# EAGLE design moja-col2 (EAGLE 6.4)
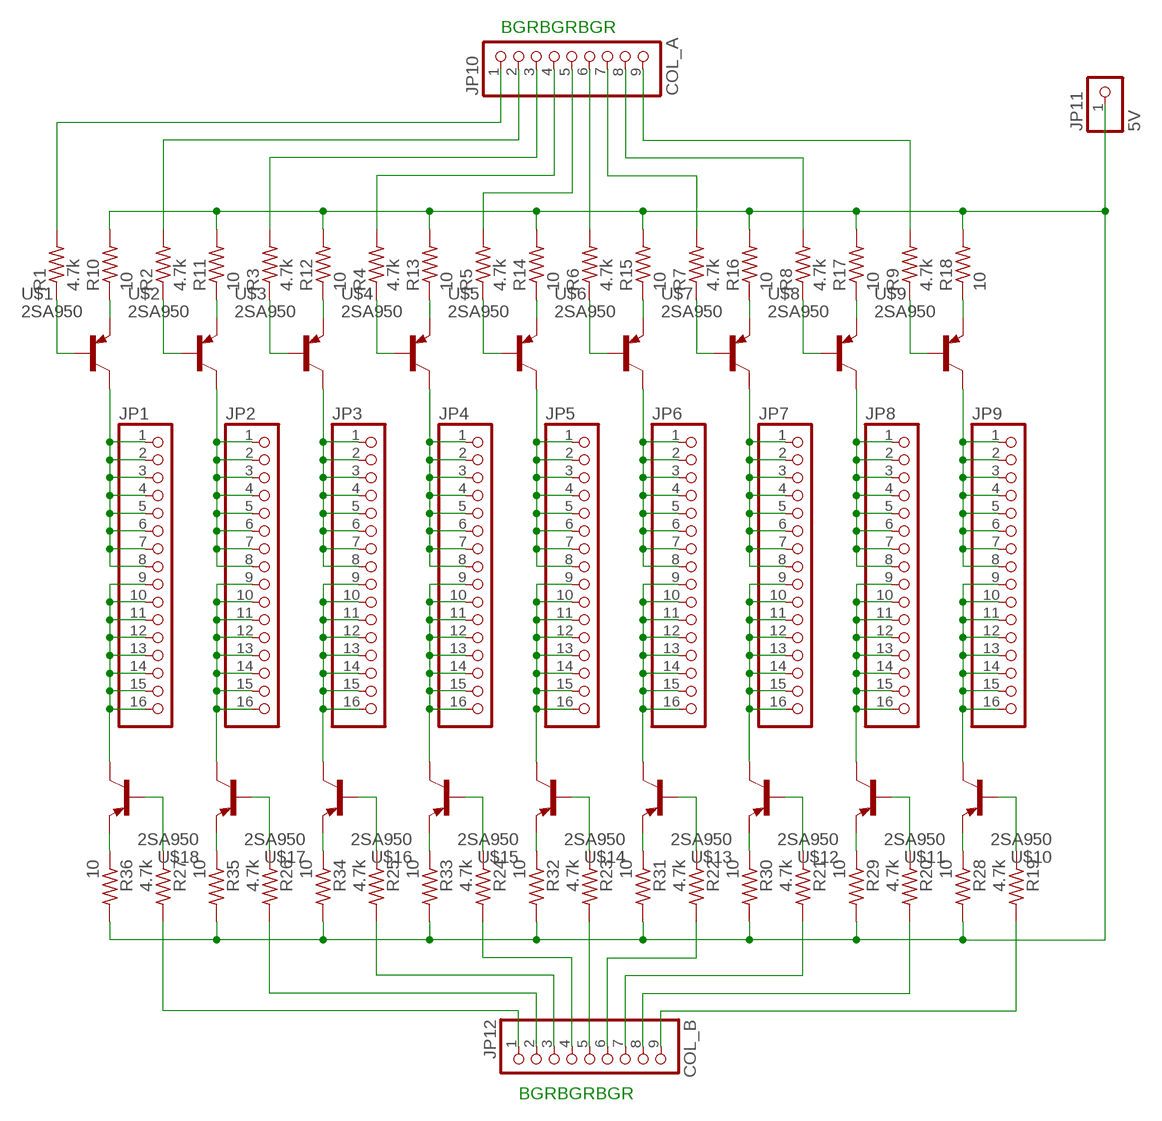
[diagram p0: schematic, sheet 1]

## Parts
JP1  PINHD-1X16  [1X16]
JP2  PINHD-1X16  [1X16]
JP3  PINHD-1X16  [1X16]
JP4  PINHD-1X16  [1X16]
JP5  PINHD-1X16  [1X16]
JP6  PINHD-1X16  [1X16]
JP7  PINHD-1X16  [1X16]
JP8  PINHD-1X16  [1X16]
JP9  PINHD-1X16  [1X16]
JP10  COL_A  PINHD-1X9  [1X09]
JP11  5V  PINHD-1X1  [1X01]
JP12  COL_B  PINHD-1X9  [1X09]
R1  4.7k  R-US_0204/2V  [0204V]
R2  4.7k  R-US_0204/2V  [0204V]
R3  4.7k  R-US_0204/2V  [0204V]
R4  4.7k  R-US_0204/2V  [0204V]
R5  4.7k  R-US_0204/2V  [0204V]
R6  4.7k  R-US_0204/2V  [0204V]
R7  4.7k  R-US_0204/2V  [0204V]
R8  4.7k  R-US_0204/2V  [0204V]
R9  4.7k  R-US_0204/2V  [0204V]
R10  10  R-US_0204/2V  [0204V]
R11  10  R-US_0204/2V  [0204V]
R12  10  R-US_0204/2V  [0204V]
R13  10  R-US_0204/2V  [0204V]
R14  10  R-US_0204/2V  [0204V]
R15  10  R-US_0204/2V  [0204V]
R16  10  R-US_0204/2V  [0204V]
R17  10  R-US_0204/2V  [0204V]
R18  10  R-US_0204/2V  [0204V]
R19  4.7k  R-US_0204/2V  [0204V]
R20  4.7k  R-US_0204/2V  [0204V]
R21  4.7k  R-US_0204/2V  [0204V]
R22  4.7k  R-US_0204/2V  [0204V]
R23  4.7k  R-US_0204/2V  [0204V]
R24  4.7k  R-US_0204/2V  [0204V]
R25  4.7k  R-US_0204/2V  [0204V]
R26  4.7k  R-US_0204/2V  [0204V]
R27  4.7k  R-US_0204/2V  [0204V]
R28  10  R-US_0204/2V  [0204V]
R29  10  R-US_0204/2V  [0204V]
R30  10  R-US_0204/2V  [0204V]
R31  10  R-US_0204/2V  [0204V]
R32  10  R-US_0204/2V  [0204V]
R33  10  R-US_0204/2V  [0204V]
R34  10  R-US_0204/2V  [0204V]
R35  10  R-US_0204/2V  [0204V]
R36  10  R-US_0204/2V  [0204V]
U$1  2SA950  [TO-92-AMMO]
U$2  2SA950  [TO-92-AMMO]
U$3  2SA950  [TO-92-AMMO]
U$4  2SA950  [TO-92-AMMO]
U$5  2SA950  [TO-92-AMMO]
U$6  2SA950  [TO-92-AMMO]
U$7  2SA950  [TO-92-AMMO]
U$8  2SA950  [TO-92-AMMO]
U$9  2SA950  [TO-92-AMMO]
U$10  2SA950  [TO-92-AMMO]
U$11  2SA950  [TO-92-AMMO]
U$12  2SA950  [TO-92-AMMO]
U$13  2SA950  [TO-92-AMMO]
U$14  2SA950  [TO-92-AMMO]
U$15  2SA950  [TO-92-AMMO]
U$16  2SA950  [TO-92-AMMO]
U$17  2SA950  [TO-92-AMMO]
U$18  2SA950  [TO-92-AMMO]

## Nets
N$1: JP1.1 JP1.2 JP1.3 JP1.4 JP1.5 JP1.6 JP1.7 JP1.8 U$1.2(C)
N$2: JP2.1 JP2.2 JP2.3 JP2.4 JP2.5 JP2.6 JP2.7 JP2.8 U$2.2(C)
N$3: JP3.1 JP3.2 JP3.3 JP3.4 JP3.5 JP3.6 JP3.7 JP3.8 U$3.2(C)
N$4: JP4.1 JP4.2 JP4.3 JP4.4 JP4.5 JP4.6 JP4.7 JP4.8 U$4.2(C)
N$5: JP5.1 JP5.2 JP5.3 JP5.4 JP5.5 JP5.6 JP5.7 JP5.8 U$5.2(C)
N$6: JP6.1 JP6.2 JP6.3 JP6.4 JP6.5 JP6.6 JP6.7 JP6.8 U$6.2(C)
N$7: JP7.1 JP7.2 JP7.3 JP7.4 JP7.5 JP7.6 JP7.7 JP7.8 U$7.2(C)
N$8: JP8.1 JP8.2 JP8.3 JP8.4 JP8.5 JP8.6 JP8.7 JP8.8 U$8.2(C)
N$9: JP9.1 JP9.2 JP9.3 JP9.4 JP9.5 JP9.6 JP9.7 JP9.8 U$9.2(C)
N$10: JP10.1 R1.2
N$11: JP10.2 R2.2
N$12: JP10.3 R3.2
N$13: JP10.4 R4.2
N$14: JP10.5 R5.2
N$15: JP10.6 R6.2
N$16: JP10.7 R7.2
N$17: JP10.8 R8.2
N$18: JP10.9 R9.2
N$19: JP1.9 JP1.10 JP1.11 JP1.12 JP1.13 JP1.14 JP1.15 JP1.16 U$18.2(C)
N$20: JP2.9 JP2.10 JP2.11 JP2.12 JP2.13 JP2.14 JP2.15 JP2.16 U$17.2(C)
N$21: JP3.9 JP3.10 JP3.11 JP3.12 JP3.13 JP3.14 JP3.15 JP3.16 U$16.2(C)
N$22: JP4.9 JP4.10 JP4.11 JP4.12 JP4.13 JP4.14 JP4.15 JP4.16 U$15.2(C)
N$23: JP5.9 JP5.10 JP5.11 JP5.12 JP5.13 JP5.14 JP5.15 JP5.16 U$14.2(C)
N$24: JP6.9 JP6.10 JP6.11 JP6.12 JP6.13 JP6.14 JP6.15 JP6.16 U$13.2(C)
N$25: JP7.9 JP7.10 JP7.11 JP7.12 JP7.13 JP7.14 JP7.15 JP7.16 U$12.2(C)
N$26: JP8.9 JP8.10 JP8.11 JP8.12 JP8.13 JP8.14 JP8.15 JP8.16 U$11.2(C)
N$27: JP9.9 JP9.10 JP9.11 JP9.12 JP9.13 JP9.14 JP9.15 JP9.16 U$10.2(C)
N$28: R1.1 U$1.3(B)
N$29: R2.1 U$2.3(B)
N$30: R3.1 U$3.3(B)
N$31: R4.1 U$4.3(B)
N$32: R5.1 U$5.3(B)
N$33: R6.1 U$6.3(B)
N$34: R7.1 U$7.3(B)
N$35: R8.1 U$8.3(B)
N$36: R9.1 U$9.3(B)
N$38: R10.1 U$1.1(E)
N$39: R11.1 U$2.1(E)
N$40: R12.1 U$3.1(E)
N$41: R13.1 U$4.1(E)
N$42: R14.1 U$5.1(E)
N$43: R15.1 U$6.1(E)
N$44: R16.1 U$7.1(E)
N$45: R17.1 U$8.1(E)
N$46: R18.1 U$9.1(E)
N$49: JP12.4 R24.2
N$56: JP12.9 R19.2
N$57: JP12.8 R20.2
N$58: JP12.7 R21.2
N$59: JP12.6 R22.2
N$60: JP12.5 R23.2
N$62: JP12.3 R25.2
N$63: JP12.2 R26.2
N$64: JP12.1 R27.2
N$65: R19.1 U$10.3(B)
N$66: R20.1 U$11.3(B)
N$67: R21.1 U$12.3(B)
N$68: R22.1 U$13.3(B)
N$69: R23.1 U$14.3(B)
N$70: R24.1 U$15.3(B)
N$71: R25.1 U$16.3(B)
N$72: R26.1 U$17.3(B)
N$73: R27.1 U$18.3(B)
N$74: JP11.1 R10.2 R11.2 R12.2 R13.2 R14.2 R15.2 R16.2 R17.2 R18.2 R28.2 R29.2 R30.2 R31.2 R32.2 R33.2 R34.2 R35.2 R36.2
N$75: R28.1 U$10.1(E)
N$76: R29.1 U$11.1(E)
N$77: R30.1 U$12.1(E)
N$78: R31.1 U$13.1(E)
N$79: R32.1 U$14.1(E)
N$80: R33.1 U$15.1(E)
N$81: R34.1 U$16.1(E)
N$82: R35.1 U$17.1(E)
N$83: R36.1 U$18.1(E)

## Notes on the sheet
- BGRBGRBGR
- BGRBGRBGR

## Library data of the parts
JP1-JP9 = pinhead:PINHD-1X16: PIN HEADER
JP10 JP12 = pinhead:PINHD-1X9: PIN HEADER
JP11 = pinhead:PINHD-1X1: PIN HEADER
R1-R36 = resistor:R-US_: RESISTOR, American symbol
U$1-U$18 = jun930:2SA950

## Board
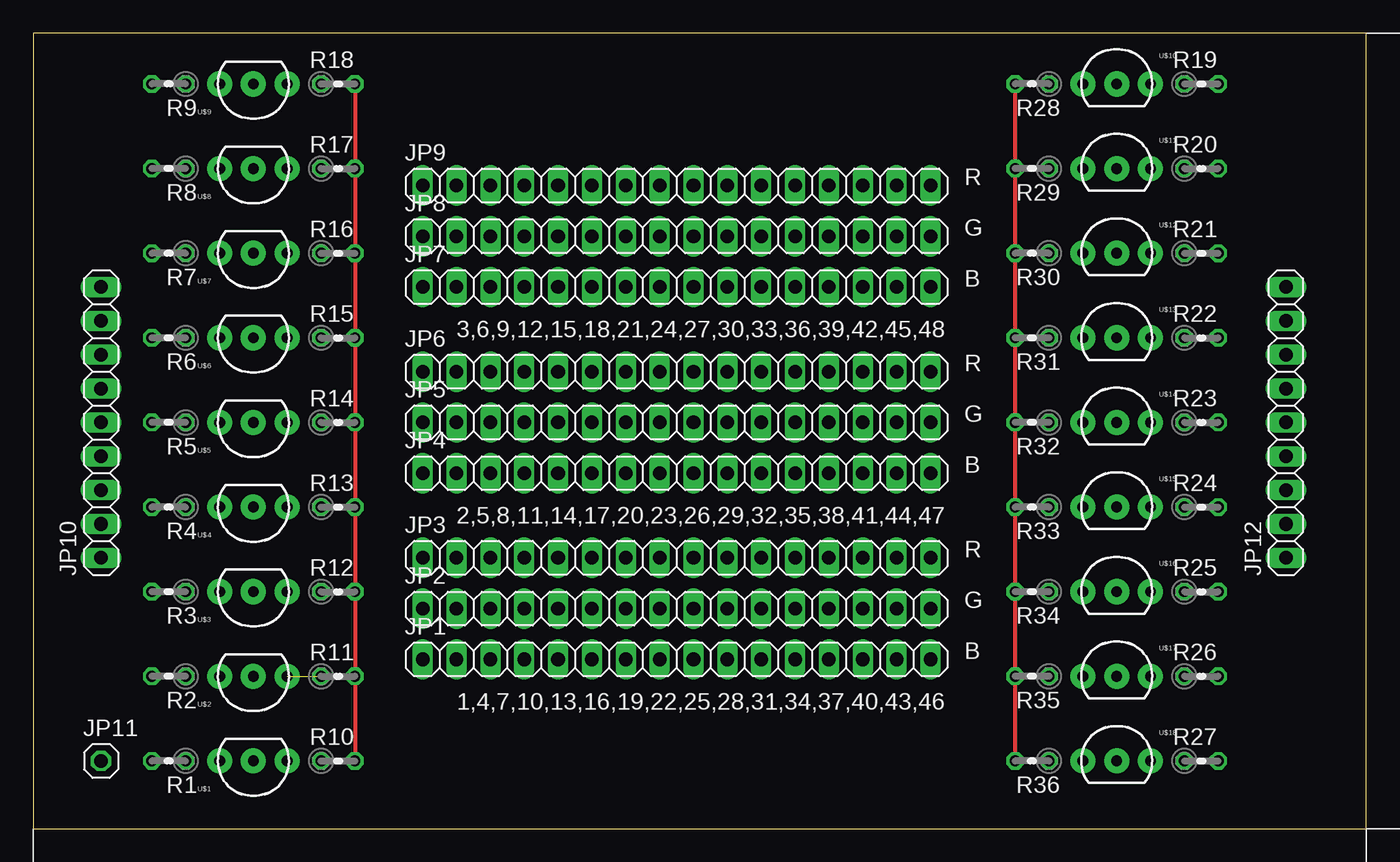
[diagram p1: board, top side]
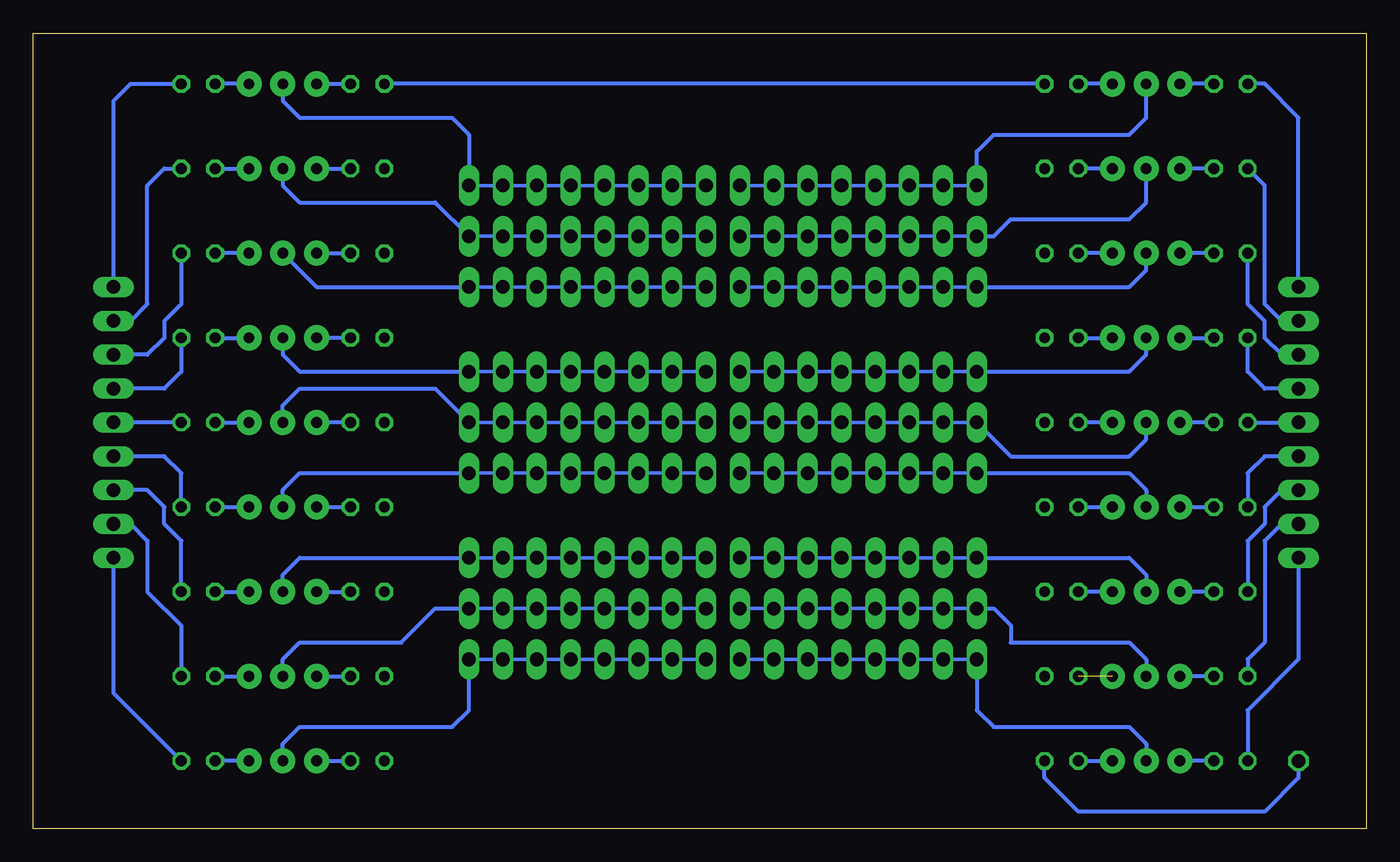
[diagram p2: board, bottom side, seen from below]

Size 100 x 59.68 mm. Coordinates in mm from the lower left corner, seen from the top.
Outline: 0,0 100,0 100,59.68 0,59.68 0,0
Copper layers (1*16): Top 0.035mm / dielectric 1.5mm / Bottom 0.035mm
Design rules "default": minimum track width 10mil, minimum drill 24mil, track to track 8mil, track to pad 8mil, pad to pad 8mil, via to via 8mil, smd to smd 8mil, copper to edge 40mil, drill to drill 8mil, minimum pad ring 10mil, minimum via ring 8mil, stop-mask expansion 4mil, vias tented up to drill 0mil, thermal gap 10mil

### Footprints (pad centres in the part's own frame; a part is rotated, then mirrored left to right if it is on the bottom)
1X16 = drill 1.016 long: 1 -19.05,0; 2 -16.51,0; 3 -13.97,0; 4 -11.43,0; 5 -8.89,0; 6 -6.35,0; 7 -3.81,0; 8 -1.27,0; 9 1.27,0; 10 3.81,0; 11 6.35,0; 12 8.89,0; 13 11.43,0; 14 13.97,0; 15 16.51,0; 16 19.05,0
1X09 = drill 1.016 long: 1 -10.16,0; 2 -7.62,0; 3 -5.08,0; 4 -2.54,0; 5 0,0; 6 2.54,0; 7 5.08,0; 8 7.62,0; 9 10.16,0
1X01 = drill 1.016 octagon: 1 0,0
0204V = drill 0.813 octagon: 1 -1.27,0; 2 1.27,0
TO-92-AMMO = drill 0.813 pad 1.88: 1 -2.54,0; 2 0,0; 3 2.54,0

### Placement (x,y rotation side)
JP1  48.26,12.7 0 top
JP2  48.26,16.51 0 top
JP3  48.26,20.32 0 top
JP4  48.26,26.67 0 top
JP5  48.26,30.48 0 top
JP6  48.26,34.29 0 top
JP7  48.26,40.64 0 top
JP8  48.26,44.45 0 top
JP9  48.26,48.26 0 top
JP10  5.08,30.48 90 top
JP11  5.08,5.08 0 top
JP12  93.98,30.48 90 top
R1  10.16,5.08 180 top
R2  10.16,11.43 180 top
R3  10.16,17.78 180 top
R4  10.16,24.13 180 top
R5  10.16,30.48 180 top
R6  10.16,36.83 180 top
R7  10.16,43.18 180 top
R8  10.16,49.53 180 top
R9  10.16,55.88 180 top
R10  22.86,5.08 0 top
R11  22.86,11.43 0 top
R12  22.86,17.78 0 top
R13  22.86,24.13 0 top
R14  22.86,30.48 0 top
R15  22.86,36.83 0 top
R16  22.86,43.18 0 top
R17  22.86,49.53 0 top
R18  22.86,55.88 0 top
R19  87.63,55.88 0 top
R20  87.63,49.53 0 top
R21  87.63,43.18 0 top
R22  87.63,36.83 0 top
R23  87.63,30.48 0 top
R24  87.63,24.13 0 top
R25  87.63,17.78 0 top
R26  87.63,11.43 0 top
R27  87.63,5.08 0 top
R28  74.93,55.88 180 top
R29  74.93,49.53 180 top
R30  74.93,43.18 180 top
R31  74.93,36.83 180 top
R32  74.93,30.48 180 top
R33  74.93,24.13 180 top
R34  74.93,17.78 180 top
R35  74.93,11.43 180 top
R36  74.93,5.08 180 top
U$1  16.51,5.08 180 top
U$2  16.51,11.43 180 top
U$3  16.51,17.78 180 top
U$4  16.51,24.13 180 top
U$5  16.51,30.48 180 top
U$6  16.51,36.83 180 top
U$7  16.51,43.18 180 top
U$8  16.51,49.53 180 top
U$9  16.51,55.88 180 top
U$10  81.28,55.88 0 top
U$11  81.28,49.53 0 top
U$12  81.28,43.18 0 top
U$13  81.28,36.83 0 top
U$14  81.28,30.48 0 top
U$15  81.28,24.13 0 top
U$16  81.28,17.78 0 top
U$17  81.28,11.43 0 top
U$18  81.28,5.08 0 top

### Tracks (layer width: path | path; a pad name or v marks a point on that pad's centre or on a via)
N$1
  Bottom 0.254: JP1.1 JP1.2 JP1.3 JP1.4 JP1.5 JP1.6 JP1.7 JP1.8
  Bottom 0.305: JP1.1 29.21,8.89 27.94,7.62 17.78,7.62 16.51,6.35 U$1.2
N$2
  Bottom 0.254: JP2.1 JP2.2 JP2.3 JP2.4 JP2.5 JP2.6 JP2.7 JP2.8
  Bottom 0.305: JP2.1 27.94,16.51 26.67,15.24 26.67,13.97 17.78,13.97 16.51,12.7 U$2.2
N$3
  Bottom 0.254: JP3.1 JP3.2 JP3.3 JP3.4 JP3.5 JP3.6 JP3.7 JP3.8
  Bottom 0.305: JP3.1 17.78,20.32 16.51,19.05 U$3.2
N$4
  Bottom 0.254: JP4.1 JP4.2 JP4.3 JP4.4 JP4.5 JP4.6 JP4.7 JP4.8
  Bottom 0.305: JP4.1 17.78,26.67 16.51,25.4 U$4.2
N$5
  Bottom 0.254: JP5.1 JP5.2 JP5.3 JP5.4 JP5.5 JP5.6 JP5.7 JP5.8
  Bottom 0.305: JP5.1 26.67,27.94 17.78,27.94 16.51,29.21 U$5.2
N$6
  Bottom 0.254: JP6.1 JP6.2 JP6.3 JP6.4 JP6.5 JP6.6 JP6.7 JP6.8
  Bottom 0.305: JP6.1 17.78,34.29 16.51,35.56 U$6.2
N$7
  Bottom 0.254: JP7.1 JP7.2 JP7.3 JP7.4 JP7.5 JP7.6 JP7.7 JP7.8
  Bottom 0.305: JP7.1 17.78,40.64 16.51,41.91 U$7.2
N$8
  Bottom 0.254: JP8.1 JP8.2 JP8.3 JP8.4 JP8.5 JP8.6 JP8.7 JP8.8
  Bottom 0.305: JP8.1 27.94,44.45 26.67,45.72 17.78,45.72 16.51,46.99 U$8.2
N$9
  Bottom 0.254: JP9.1 JP9.2 JP9.3 JP9.4 JP9.5 JP9.6 JP9.7 JP9.8
  Bottom 0.305: JP9.1 29.21,50.8 27.94,52.07 17.78,52.07 16.51,53.34 U$9.2
N$10
  Bottom 0.305: JP10.1 5.08,12.7 8.89,8.89 R1.2
N$11
  Bottom 0.305: JP10.2 6.35,22.86 7.62,21.59 7.62,13.97 8.89,12.7 R2.2
N$12
  Bottom 0.305: JP10.3 6.35,25.4 7.62,24.13 7.62,22.86 8.89,21.59 R3.2
N$13
  Bottom 0.305: JP10.4 7.62,27.94 8.89,26.67 R4.2
N$14
  Bottom 0.305: R5.2 JP10.5
N$15
  Bottom 0.305: JP10.6 7.62,33.02 8.89,34.29 R6.2
N$16
  Bottom 0.305: JP10.7 6.35,35.56 7.62,36.83 7.62,38.1 8.89,39.37 R7.2
N$17
  Bottom 0.305: JP10.8 6.35,38.1 7.62,39.37 7.62,48.26 R8.2
N$18
  Bottom 0.305: JP10.9 5.08,53.34 7.62,55.88 R9.2
N$19
  Bottom 0.254: JP1.9 JP1.10 JP1.11 JP1.12 JP1.13 JP1.14 JP1.15 JP1.16
  Bottom 0.305: U$18.2 81.28,6.35 80.01,7.62 68.58,7.62 67.31,8.89 JP1.16
N$20
  Bottom 0.254: JP2.9 JP2.10 JP2.11 JP2.12 JP2.13 JP2.14 JP2.15 JP2.16
  Bottom 0.305: U$17.2 81.28,12.7 80.01,13.97 72.39,13.97 69.85,16.51 JP2.16
N$21
  Bottom 0.254: JP3.9 JP3.10 JP3.11 JP3.12 JP3.13 JP3.14 JP3.15 JP3.16
  Bottom 0.305: U$16.2 81.28,19.05 80.01,20.32 JP3.16
N$22
  Bottom 0.254: JP4.9 JP4.10 JP4.11 JP4.12 JP4.13 JP4.14 JP4.15 JP4.16
  Bottom 0.305: U$15.2 81.28,25.4 80.01,26.67 JP4.16
N$23
  Bottom 0.254: JP5.9 JP5.10 JP5.11 JP5.12 JP5.13 JP5.14 JP5.15 JP5.16
  Bottom 0.305: U$14.2 81.28,31.75 80.01,33.02 69.85,33.02 JP5.16
N$24
  Bottom 0.254: JP6.9 JP6.10 JP6.11 JP6.12 JP6.13 JP6.14 JP6.15 JP6.16
  Bottom 0.305: U$13.2 81.28,35.56 80.01,34.29 JP6.16
N$25
  Bottom 0.254: JP7.9 JP7.10 JP7.11 JP7.12 JP7.13 JP7.14 JP7.15 JP7.16
  Bottom 0.305: U$12.2 78.74,40.64 JP7.16
N$26
  Bottom 0.254: JP8.9 JP8.10 JP8.11 JP8.12 JP8.13 JP8.14 JP8.15 JP8.16
  Bottom 0.305: U$11.2 81.28,48.26 80.01,46.99 69.85,46.99 JP8.16
N$27
  Bottom 0.254: JP9.9 JP9.10 JP9.11 JP9.12 JP9.13 JP9.14 JP9.15 JP9.16
  Bottom 0.305: U$10.2 81.28,54.61 80.01,53.34 68.58,53.34 67.31,52.07 JP9.16
N$28
  Bottom 0.305: R1.1 U$1.3
N$29
  Bottom 0.305: R2.1 U$2.3
N$30
  Bottom 0.305: R3.1 U$3.3
N$31
  Bottom 0.305: U$4.3 R4.1
N$32
  Bottom 0.305: R5.1 U$5.3
N$33
  Bottom 0.305: U$6.3 R6.1
N$34
  Bottom 0.305: R7.1 U$7.3
N$35
  Bottom 0.305: R8.1 U$8.3
N$36
  Bottom 0.305: R9.1 U$9.3
N$38
  Bottom 0.305: R10.1 U$1.1
N$39  (1 unrouted)
N$40
  Bottom 0.305: U$3.1 R12.1
N$41
  Bottom 0.305: R13.1 U$4.1
N$42
  Bottom 0.305: U$5.1 R14.1
N$43
  Bottom 0.305: R15.1 U$6.1
N$44
  Bottom 0.305: U$7.1 R16.1
N$45
  Bottom 0.305: U$8.1 R17.1
N$46
  Bottom 0.305: U$9.1 R18.1
N$49
  Bottom 0.305: R24.2 88.9,26.67 90.17,27.94 JP12.4
N$56
  Bottom 0.305: JP12.9 93.98,54.61 92.71,55.88 R19.2
N$57
  Bottom 0.305: JP12.8 92.71,38.1 91.44,39.37 91.44,48.26 90.17,49.53 R20.2
N$58
  Bottom 0.305: R21.2 88.9,39.37 90.17,38.1 90.17,36.83 91.44,35.56 JP12.7
N$59
  Bottom 0.305: R22.2 88.9,34.29 90.17,33.02 JP12.6
N$60
  Bottom 0.305: R23.2 JP12.5
N$62
  Bottom 0.305: R25.2 88.9,21.59 90.17,22.86 90.17,24.13 91.44,25.4 JP12.3
N$63
  Bottom 0.305: JP12.2 92.71,22.86 91.44,21.59 91.44,17.78 88.9,15.24 R26.2
N$64
  Bottom 0.305: R27.2 93.98,10.16 JP12.1
N$65
  Bottom 0.305: U$10.3 R19.1
N$66
  Bottom 0.305: R20.1 U$11.3
N$67
  Bottom 0.305: U$12.3 R21.1
N$68
  Bottom 0.305: R22.1 U$13.3
N$69
  Bottom 0.305: R23.1 U$14.3
N$70
  Bottom 0.305: R24.1 U$15.3
N$71
  Bottom 0.305: R25.1 U$16.3
N$72
  Bottom 0.305: R26.1 U$17.3
N$73
  Bottom 0.305: U$18.3 R27.1
N$74
  Top 0.305: R18.2 R17.2 R16.2 R15.2 R14.2 R13.2 R12.2 R11.2 R10.2 | R28.2 R29.2 R30.2 R31.2 R32.2 R33.2 R34.2 R35.2 R36.2
  Bottom 0.305: JP11.1 5.08,3.81 7.62,1.27 21.59,1.27 24.13,3.81 R10.2 | R18.2 R28.2
N$75
  Bottom 0.305: U$10.1 R28.1
N$76
  Bottom 0.305: U$11.1 R29.1
N$77
  Bottom 0.305: U$12.1 R30.1
N$78
  Bottom 0.305: R31.1 U$13.1
N$79
  Bottom 0.305: R32.1 U$14.1
N$80
  Bottom 0.305: U$15.1 R33.1
N$81
  Bottom 0.305: U$16.1 R34.1
N$82
  Bottom 0.305: U$17.1 R35.1
N$83
  Bottom 0.305: U$18.1 R36.1

### Text on the board
tPlace: R | G | B | 3,6,9,12,15,18,21,24,27,30,33,36,39,42,45,48 | R | G | B | 2,5,8,11,14,17,20,23,26,29,32,35,38,41,44,47 | R | G | B | 1,4,7,10,13,16,19,22,25,28,31,34,37,40,43,46